# EAGLE design OttoPi06a-RPi3AHAT (EAGLE 9.6.2)
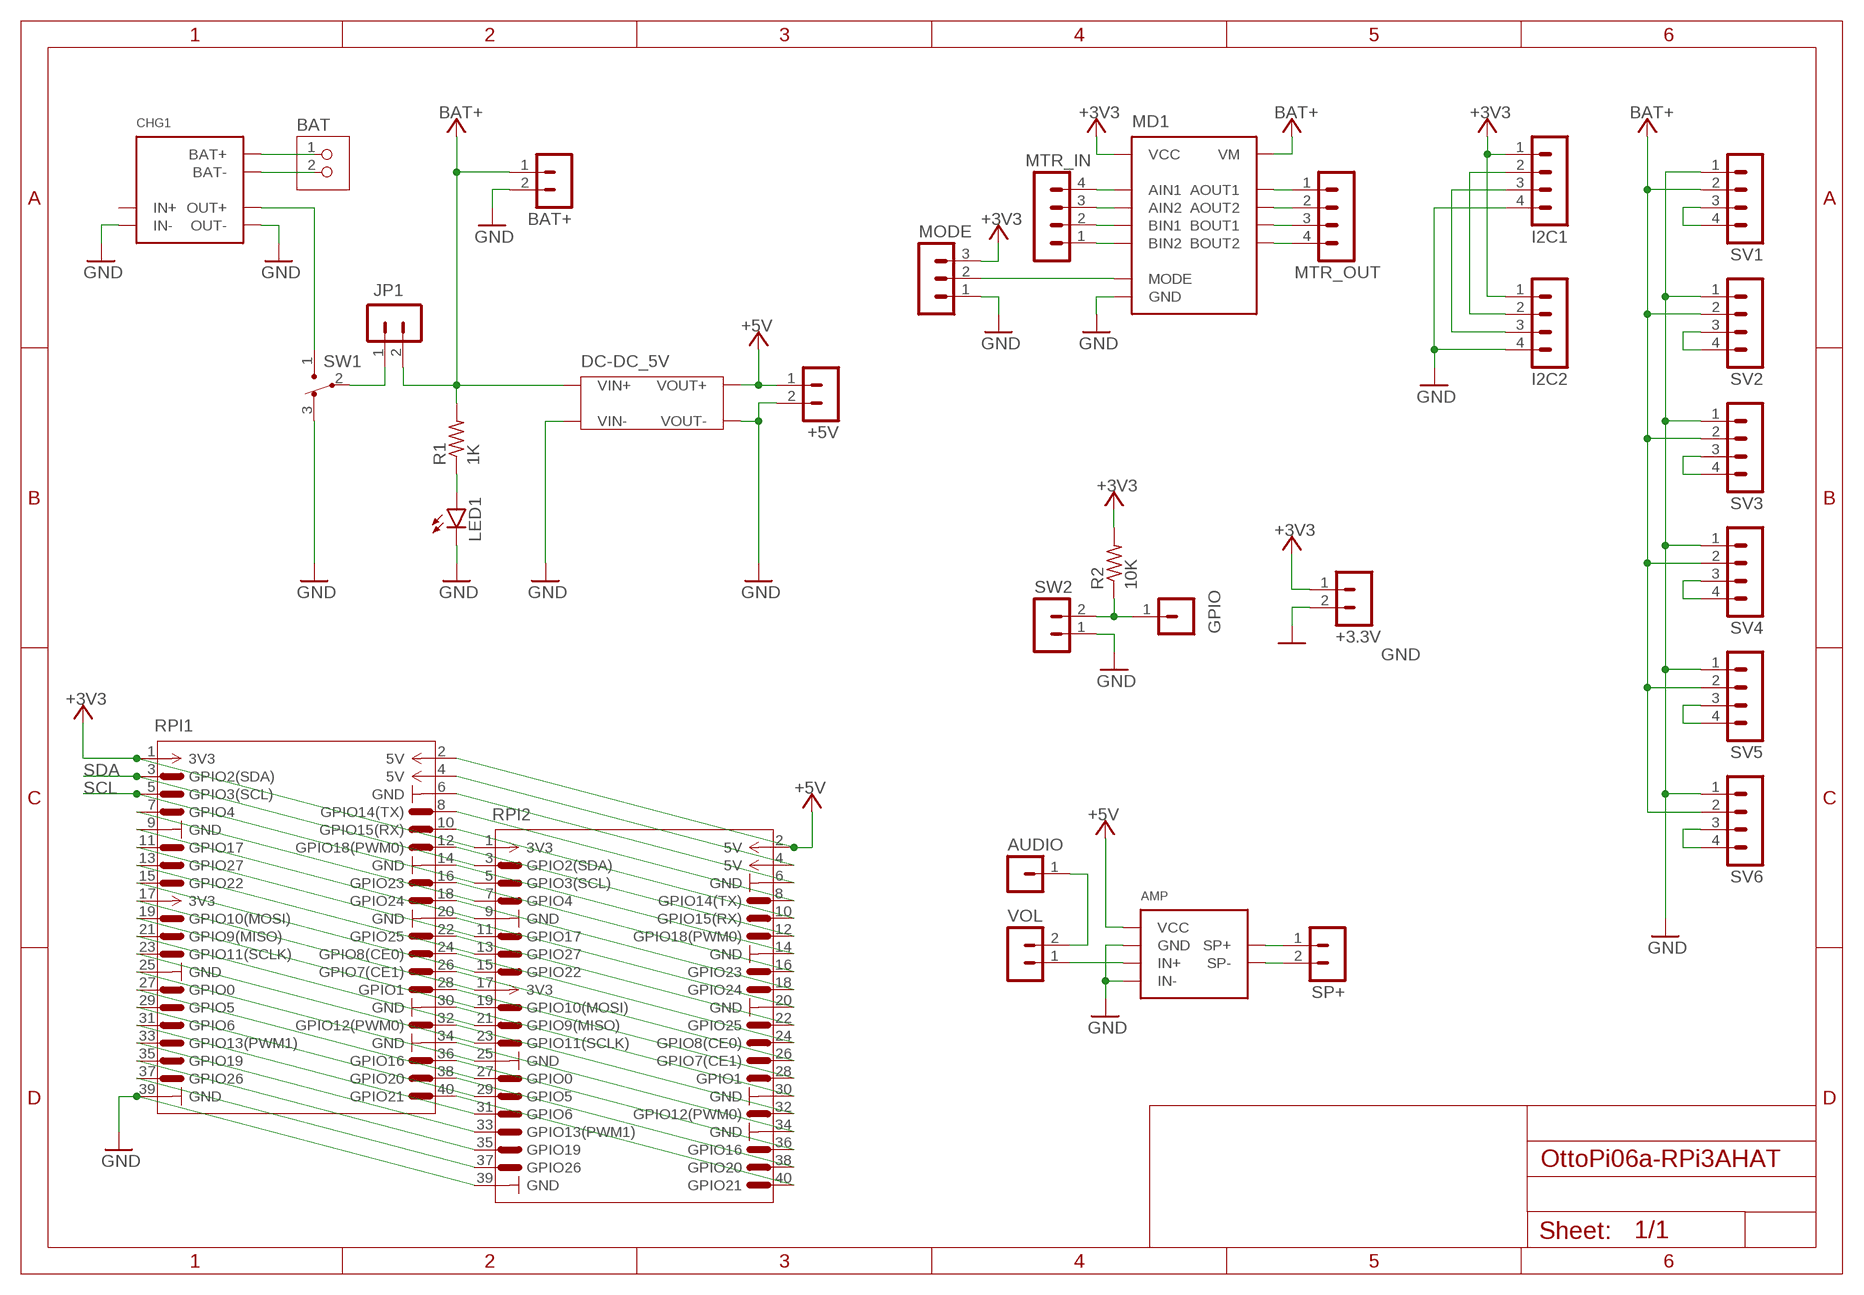
[diagram p0: schematic, sheet 1]

## Parts
+3.3V  MA02-1  [MA02-1]
+5V  MA02-1  [MA02-1]
AMP  PAM8012MOD  [PAM8012MOD-A]
AUDIO  MA01-1  [MA01-1]
BAT  JST-PH2  [JST-PH2]
BAT+  MA02-1  [MA02-1]
CHG1  TP4056MOD1  [TP4056MOD1]
DC-DC_5V  DCDC-5V_28V-2A  [DCDC-5V_28V-2A]
GPIO  MA01-1  [MA01-1]
I2C1  MA04-1  [MA04-1]
I2C2  MA04-1  [MA04-1]
JP1  MA02-1  [MA02-1]
LED1  LED3MM  [LED3MM]
MD1  DRV8835MOD  [DRV8835MOD]
MODE  MA03-1  [MA03-1]
MTR_IN  MA04-1  [MA04-1]
MTR_OUT  MA04-1  [MA04-1]
R1  1K  R-US_0204/7  [0204/7]
R2  10K  R-US_0204/7  [0204/7]
RPI1  RPI-PIN  [RPI-PIN]
RPI2  RPI-PIN  [RPI-PIN]
SP+  MA02-1  [MA02-1]
SV1  MA04-1  [MA04-1]
SV2  MA04-1  [MA04-1]
SV3  MA04-1  [MA04-1]
SV4  MA04-1  [MA04-1]
SV5  MA04-1  [MA04-1]
SV6  MA04-1  [MA04-1]
SW1  SW3-1  [SW3-1]
SW2  MA02-1  [MA02-1]
VOL  MA02-1  [MA02-1]

## Nets
+3V3: +3.3V.1 I2C1.1 I2C2.1 MD1.VCC MODE.3 R2.2 RPI1.1(3V3) RPI2.1(3V3)
+5V: +5V.1 AMP.V+(VCC) DC-DC_5V.VOUT+ RPI1.2(5V) RPI2.2(5V)
AIN1: MD1.AIN1 MTR_IN.4
AIN2: MD1.AIN2 MTR_IN.3
AOUT1: MD1.AOUT1 MTR_OUT.1
AOUT2: MD1.AOUT2 MTR_OUT.2
AUDIO0: AUDIO.1 VOL.2
AUDIO1: AMP.IN+ VOL.1
BAT+: BAT+.1 DC-DC_5V.VIN+ JP1.2 MD1.VM R1.2 SV1.2 SV2.2 SV3.2 SV4.2 SV5.2 SV6.2
BAT+0: BAT.1 CHG1.BAT+
BAT+1: CHG1.OUT+ SW1.1
BAT+2: JP1.1 SW1.2
BAT-0: BAT.2 CHG1.BAT-
BIN1: MD1.BIN1 MTR_IN.2
BIN2: MD1.BIN2 MTR_IN.1
BOUT1: MD1.BOUT1 MTR_OUT.3
BOUT2: MD1.BOUT2 MTR_OUT.4
GND: +3.3V.2 +5V.2 AMP.GND AMP.IN- BAT+.2 CHG1.IN- CHG1.OUT- DC-DC_5V.VIN- DC-DC_5V.VOUT- I2C1.4 I2C2.4 LED1.K(C) MD1.GND MODE.1 RPI1.39(GND) RPI2.39(GND) SV1.1 SV2.1 SV3.1 SV4.1 SV5.1 SV6.1 SW1.3 SW2.1
MODE: MD1.MODE MODE.2
N$1: RPI1.17(3V3) RPI2.17(3V3)
N$3: LED1.A R1.1
N$4: GPIO.1 R2.1 SW2.2
N$7: RPI1.7(GPIO4) RPI2.7(GPIO4)
N$8: RPI1.9(GND) RPI2.9(GND)
N$9: RPI1.11(GPIO17) RPI2.11(GPIO17)
N$10: RPI1.13(GPIO27) RPI2.13(GPIO27)
N$11: RPI1.15(GPIO22) RPI2.15(GPIO22)
N$12: RPI1.23(GPIO11(SCLK)) RPI2.23(GPIO11(SCLK))
N$13: RPI1.19(GPIO10(MOSI)) RPI2.19(GPIO10(MOSI))
N$14: RPI1.21(GPIO9(MISO)) RPI2.21(GPIO9(MISO))
N$16: RPI1.4(5V) RPI2.4(5V)
N$17: RPI1.6(GND) RPI2.6(GND)
N$18: RPI1.8(GPIO14(TX)) RPI2.8(GPIO14(TX))
N$19: RPI1.10(GPIO15(RX)) RPI2.10(GPIO15(RX))
N$20: RPI1.12(GPIO18(PWM0)) RPI2.12(GPIO18(PWM0))
N$21: RPI1.16(GPIO23) RPI2.16(GPIO23)
N$22: RPI1.18(GPIO24) RPI2.18(GPIO24)
N$23: RPI1.22(GPIO25) RPI2.22(GPIO25)
N$24: RPI1.14(GND) RPI2.14(GND)
N$26: RPI1.20(GND) RPI2.20(GND)
N$27: RPI1.24(GPIO8(CE0)) RPI2.24(GPIO8(CE0))
N$28: RPI1.26(GPIO7(CE1)) RPI2.26(GPIO7(CE1))
N$29: RPI1.27(GPIO0) RPI2.27(GPIO0)
N$30: RPI1.28(GPIO1) RPI2.28(GPIO1)
N$31: RPI1.29(GPIO5) RPI2.29(GPIO5)
N$32: RPI1.31(GPIO6) RPI2.31(GPIO6)
N$33: RPI1.32(GPIO12(PWM0)) RPI2.32(GPIO12(PWM0))
N$34: RPI1.33(GPIO13(PWM1)) RPI2.33(GPIO13(PWM1))
N$35: RPI1.35(GPIO19) RPI2.35(GPIO19)
N$36: RPI1.36(GPIO16) RPI2.36(GPIO16)
N$37: RPI1.37(GPIO26) RPI2.37(GPIO26)
N$38: RPI1.38(GPIO20) RPI2.38(GPIO20)
N$39: RPI1.40(GPIO21) RPI2.40(GPIO21)
N$40: RPI1.25(GND) RPI2.25(GND)
N$41: RPI1.30(GND) RPI2.30(GND)
N$42: RPI1.34(GND) RPI2.34(GND)
N$47: SV2.3 SV2.4
N$48: SV3.3 SV3.4
N$49: SV4.3 SV4.4
N$51: SV1.3 SV1.4
N$63: SV5.3 SV5.4
N$64: SV6.3 SV6.4
SCL: I2C1.3 I2C2.3 RPI1.5(GPIO3(SCL)) RPI2.5(GPIO3(SCL))
SDA: I2C1.2 I2C2.2 RPI1.3(GPIO2(SDA)) RPI2.3(GPIO2(SDA))
SP+: AMP.SP+@1(SP+) SP+.1
SP-: AMP.SP-@1(SP-) SP+.2
Unconnected: CHG1.IN+

## Library data of the parts
+3.3V +5V BAT+ JP1 SP+ SW2 VOL = ytani-con-lstb:MA02-1: PIN HEADER
AMP = ytani1:PAM8012MOD: PAM8012使用2W D級アンプモジュール https://akizukidenshi.com/catalog/g/gK-08217/ Vin: 2.5V-5.5V 8ohm: 1W 4ohm: 2W IN-をGNDに接続することでシングルエンド入力としても使用できます。; CHIP1: PAM8012; OC_AKIZUKI: K-08217; URL_AKIZUKI: https://akizukidenshi.com/catalog/g/gK-08217/
AUDIO GPIO = ytani-con-lstb:MA01-1
BAT = ytani1:JST-PH2
CHG1 = ytani1:TP4056MOD1: LiPoバッテリー充電コントローラ(TP4056) https://www.amazon.co.jp/dp/B073J66H62/; URL_AMAZON: https://www.amazon.co.jp/dp/B073J66H62/
DC-DC_5V = ytani1:DCDC-5V_28V-2A: Step-Up DC/DC converter https://www.amazon.co.jp/gp/product/B01D0WSBGY/ In 2V-24V Out 5V-28V = [VALUE] Max: 2A (1A recomended); URL_AMAZON: https://www.amazon.co.jp/gp/product/B01D0WSBGY/
I2C1 I2C2 MTR_IN MTR_OUT SV1-SV6 = ytani-con-lstb:MA04-1: PIN HEADER; OC_FARNELL: unknown; OC_NEWARK: unknown
LED1 = led:LED: LED OSRAM: - CHIPLED LG R971, LG N971, LY N971, LG Q971, LY Q971, LO R971, LY R971 LH N974, LH R974 LS Q976, LO Q976, LY Q976 LO Q996 - Hyper CHIPLED LW Q18S LB Q993, LB Q99A, LB R99A - SideLED LS A670, LO A670, LY A670, LG A670, LP A670 LB A673, LV A673, LT A673, LW A673 LH A674 LY A675 LS A676, LA A676, LO A676, LY A676, LW A676 LS A679, LY A679, LG A679 - Hyper Micro SIDELED® LS Y876, LA Y876, LO Y876, LY Y876 LT Y87S - SmartLED LW L88C, LW L88S LB L89C, LB L89S, LG L890 LS L89K, LO L89K, LY L89K LS L896, LA L896, LO L896, LY L896 - TOPLED LS T670, LO T670, LY T670, LG T670, LP T670 LSG T670, LSP T670, LSY T670, LOP T670, LYG T670 LG T671, LOG T671, LSG T671 LB T673, LV T673, LT T673, LW T673 LH T674 LS T676, LA T676, LO T676, LY T676, LB T676, LH T676, LSB T676, LW T676 LB T67C, LV T67C, LT T67C, LS T67K, LO T67K, LY T67K, LW E67C LS E67B, LA E67B, LO E67B, LY E67B, LB E67C, LV E67C, LT E67C LW T67C LS T679, LY T679, LG T679 LS T770, LO T770, LY T770, LG T770, LP T770 LB T773, LV T773, LT T773, LW T773 LH T774 LS E675, LA E675, LY E675, LS T675 LS T776, LA T776, LO T776, LY T776, LB T776 LHGB T686 LT T68C, LB T68C - Hyper Mini TOPLED® LB M676 - Mini TOPLED Santana® LG M470 LS M47K, LO M47K, LY M47K Source: http://www.osram.convergy.de LUXEON: - LUMILED® LXK2-PW12-R00, LXK2-PW12-S00, LXK2-PW14-U00, LXK2-PW14-V00 LXK2-PM12-R00, LXK2-PM12-S00, LXK2-PM14-U00 LXK2-PE12-Q00, LXK2-PE12-R00, LXK2-PE12-S00, LXK2-PE14-T00, LXK2-PE14-U00 LXK2-PB12-K00, LXK2-PB12-L00, LXK2-PB12-M00, LXK2-PB14-N00, LXK2-PB14-P00, LXK2-PB14-Q00 LXK2-PR12-L00, LXK2-PR12-M00, LXK2-PR14-Q00, LXK2-PR14-R00 LXK2-PD12-Q00, LXK2-PD12-R00, LXK2-PD12-S00 LXK2-PH12-R00, LXK2-PH12-S00 LXK2-PL12-P00, LXK2-PL12-Q00, LXK2-PL12-R00 Source: www.luxeon.com KINGBRIGHT: KA-3528ASYC Source: www.kingbright.com
MD1 = ytani1:DRV8835MOD: DRV8835 Motor Driver Module https://akizukidenshi.com/catalog/g/gK-09848/ Vcc = 2V-7V Vm = 0V-11V Iout = 0V-1.5A Fpwm = 0Hz-250kHz Vin = 0V-Vcc; OC_AKIZUKI: K-09848; URL_AKIZUKI: https://akizukidenshi.com/catalog/g/gK-09848/
MODE = ytani-con-lstb:MA03-1: PIN HEADER; OC_FARNELL: unknown; OC_NEWARK: unknown
R1 R2 = rcl:R-US_: RESISTOR, American symbol; SPICEPREFIX: R
RPI1 RPI2 = ytani1:RPI-PIN: Raspberry Pi pin header
SW1 = ytani1:SW3-1: Slide Switch 3x1 pin https://www.amazon.co.jp/gp/product/B01LYVYQNO/ SS12D00G3 2ポジションSPDT 1P2T 3ピン; MF: HiLetgo; URL_AMAZON: https://www.amazon.co.jp/gp/product/B01LYVYQNO/

## Board
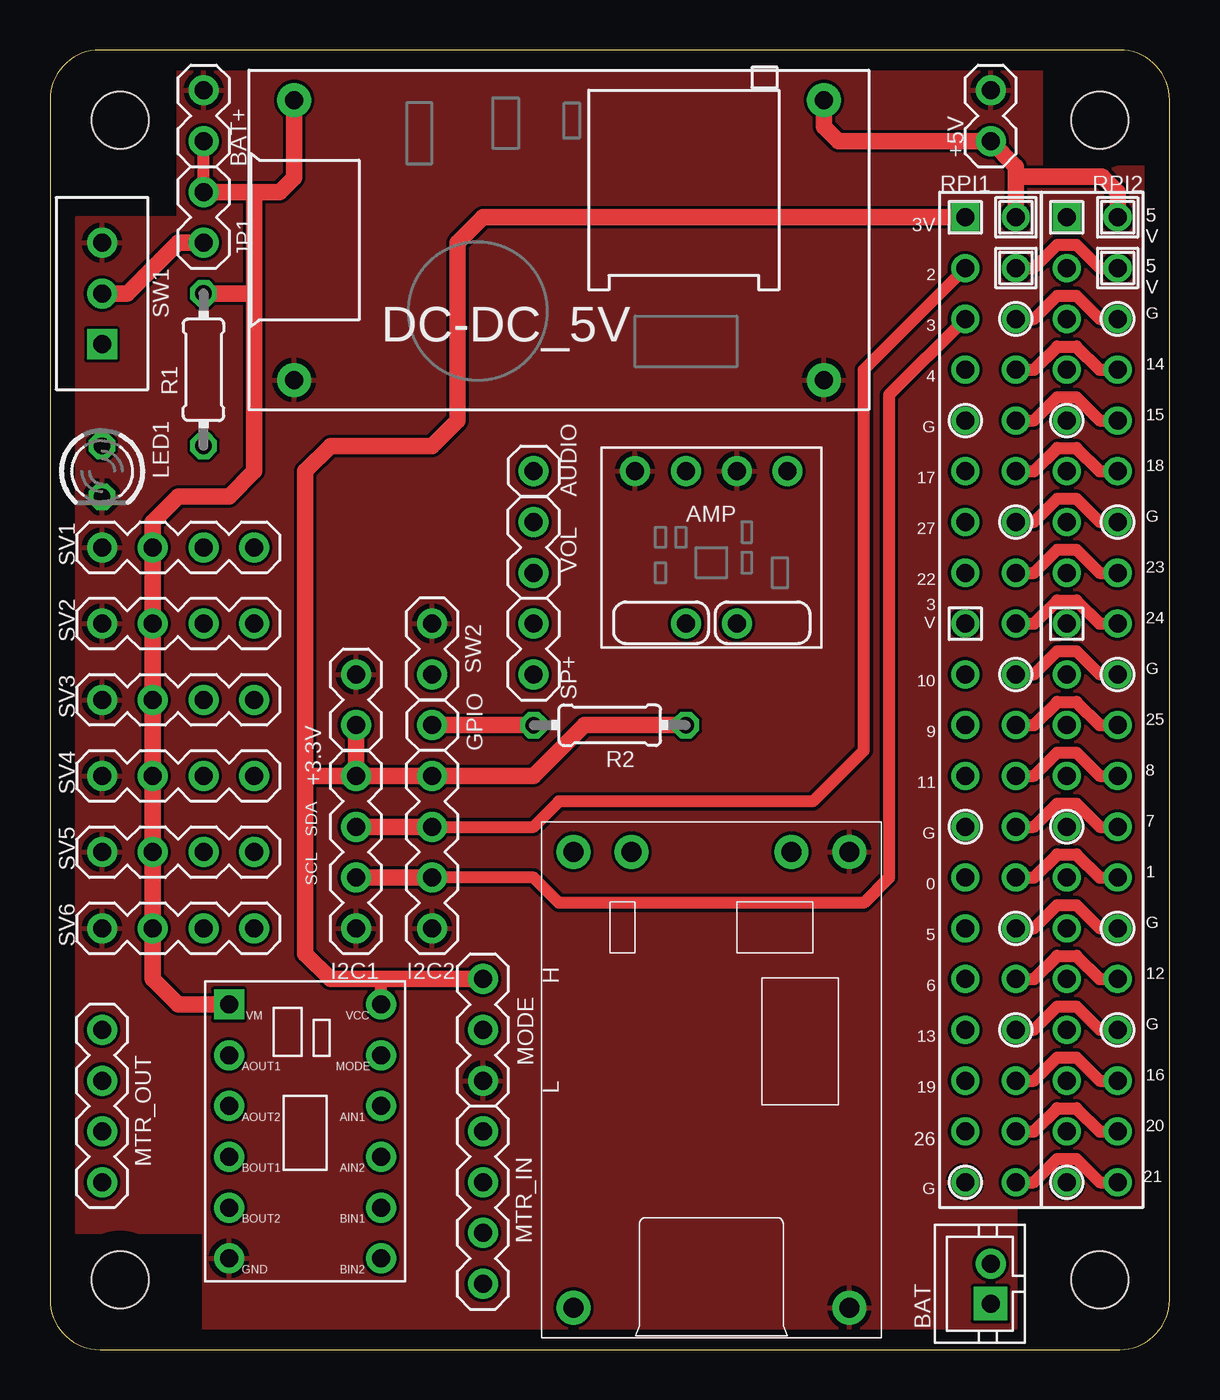
[diagram p1: board, top side]
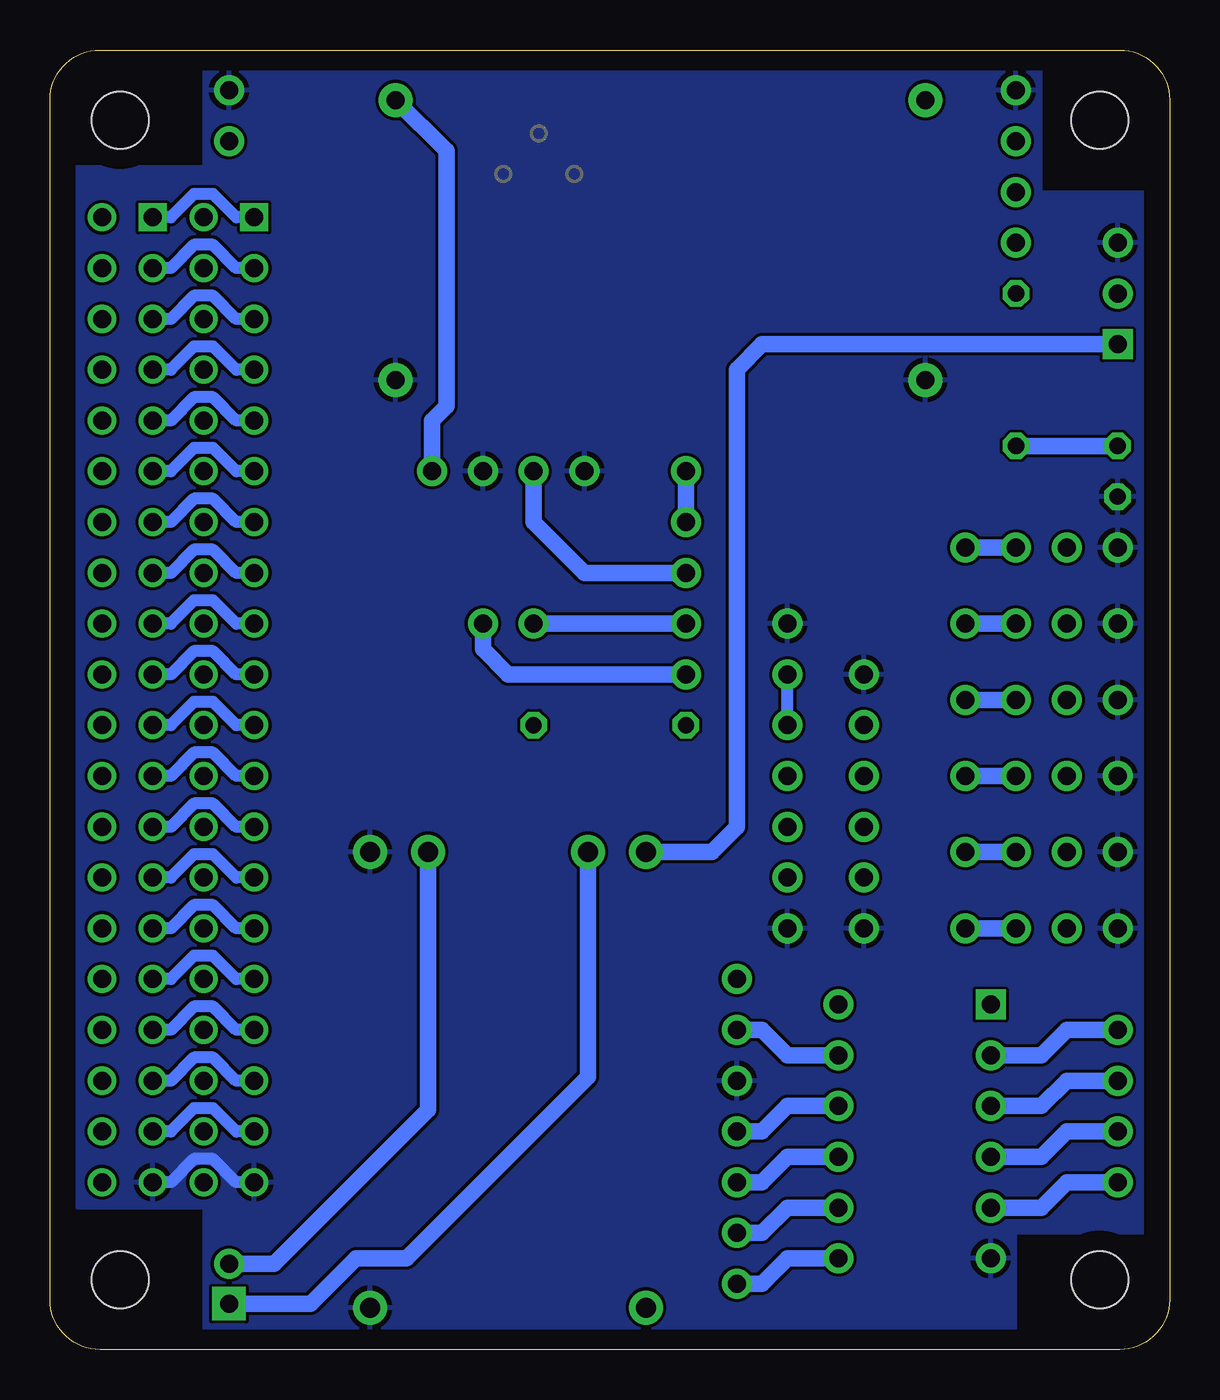
[diagram p2: board, bottom side, seen from below]

Size 56 x 65 mm. Coordinates in mm from the lower left corner, seen from the top.
Outline: 2.5,0 53.5,0 arc90 56,2.5 56,62.5 arc90 53.5,65 2.5,65 arc90 0,62.5 0,2.5 arc90 2.5,0
Copper layers (1*16): Top 0.035mm / dielectric 1.5mm / Bottom 0.035mm
Design rules "default": minimum track width 6mil, minimum drill 0.35mm, track to track 6mil, track to pad 6mil, pad to pad 6mil, via to via 6mil, smd to smd 6mil, copper to edge 40mil, drill to drill 6mil, minimum pad ring 10mil, minimum via ring 8mil, stop-mask expansion 4mil, vias tented up to drill 0mil, thermal gap 10mil
Holes 2.85 mm at 52.5,3.5 52.5,61.5 3.5,61.5 3.5,3.5

### Footprints (pad centres in the part's own frame; a part is rotated, then mirrored left to right if it is on the bottom)
MA02-1 = drill 0.9 pad 1.5: 1 -1.27,0; 2 1.27,0
PAM8012MOD-A = drill 0.9 pad 1.5: GND -3.81,1.27; IN+ -3.81,-1.27; IN- -3.81,-3.81; SP+@1 3.81,1.27; SP-@1 3.81,-1.27; V+ -3.81,3.81
MA01-1 = drill 0.9 pad 1.5: 1 1.27,0
JST-PH2 = drill 0.9 pad 1.676 square: 1 -1,0 | drill 0.9 pad 1.5: 2 1,0
TP4056MOD1 = drill 1 pad 1.7: BAT+ 11.4,4; BAT- 11.4,-4; IN+ -11.4,6.9; IN- -11.4,-6.9; OUT+ 11.4,6.9; OUT- 11.4,-6.9
DCDC-5V_28V-2A = drill 0.9 pad 1.7: VIN+ -13.25,7; VIN- -13.25,-7; VOUT+ 13.25,7; VOUT- 13.25,-7
MA04-1 = drill 0.9 pad 1.5: 1 -3.81,0; 2 -1.27,0; 3 1.27,0; 4 3.81,0
LED3MM = drill 0.813 octagon: A -1.27,0; K 1.27,0
DRV8835MOD = drill 0.9 pad 1.5: AIN1 5.08,5.08; AIN2 5.08,2.54; AOUT1 -2.54,7.62; AOUT2 -2.54,5.08; BIN1 5.08,0; BIN2 5.08,-2.54; BOUT1 -2.54,2.54; BOUT2 -2.54,0; GND -2.54,-2.54; MODE 5.08,7.62; VCC 5.08,10.16 | drill 0.9 pad 1.5 square: VM -2.54,10.16
MA03-1 = drill 0.9 pad 1.5: 1 -1.27,0; 2 1.27,0; 3 3.81,0
0204/7 = drill 0.813 octagon: 1 -3.81,0; 2 3.81,0
RPI-PIN = drill 0.9 square: 1 -1.27,24.13 | drill 0.9: 2 1.27,24.13; 3 -1.27,21.59; 4 1.27,21.59; 5 -1.27,19.05; 6 1.27,19.05; 7 -1.27,16.51; 8 1.27,16.51; 9 -1.27,13.97; 10 1.27,13.97; 11 -1.27,11.43; 12 1.27,11.43; 13 -1.27,8.89; 14 1.27,8.89; 15 -1.27,6.35; 16 1.27,6.35; 17 -1.27,3.81; 18 1.27,3.81; 19 -1.27,1.27; 20 1.27,1.27; 21 -1.27,-1.27; 22 1.27,-1.27; 23 -1.27,-3.81; 24 1.27,-3.81; 25 -1.27,-6.35; 26 1.27,-6.35; 27 -1.27,-8.89; 28 1.27,-8.89; 29 -1.27,-11.43; 30 1.27,-11.43; 31 -1.27,-13.97; 32 1.27,-13.97; 33 -1.27,-16.51; 34 1.27,-16.51; 35 -1.27,-19.05; 36 1.27,-19.05; 37 -1.27,-21.59; 38 1.27,-21.59; 39 -1.27,-24.13; 40 1.27,-24.13
SW3-1 = drill 0.9 pad 1.5 square: 1 -1.27,0 | drill 0.9 pad 1.5: 2 1.27,0; 3 3.81,0

### Placement (x,y rotation side)
+3.3V  15.3,32.5 90 top
+5V  47.05,61.71 90 top
AMP  33.08,40.12 270 top
AUDIO  22.92,43.93 0 top
BAT  47.05,3.29 90 top
BAT+  7.68,61.71 90 top
CHG1  33.08,13.5 90 top
DC-DC_5V  25.46,55.5 0 top
GPIO  17.84,31.23 0 top
I2C1  15.3,24.88 270 top
I2C2  19.11,24.88 270 top
JP1  7.68,56.63 90 top
LED1  2.6,43.93 270 top
MD1  11.49,7.1 0 top
MODE  21.65,14.72 90 top
MTR_IN  21.65,7.1 90 top
MTR_OUT  2.6,12.18 270 top
R1  7.68,49.01 90 top
R2  28,31.23 0 top
RPI1  47.05,32.5 0 top
RPI2  52.13,32.5 0 top
SP+  24.19,35.04 90 top
SV1  6.41,40.12 0 top
SV2  6.41,36.31 0 top
SV3  6.41,32.5 0 top
SV4  6.41,28.69 0 top
SV5  6.41,24.88 0 top
SV6  6.41,21.07 0 top
SW1  2.6,51.55 90 top
SW2  19.11,35.04 270 top
VOL  24.19,40.12 90 top

### Tracks (layer width: path | path; a pad name or v marks a point on that pad's centre or on a via)
+3V3
  Top 0.61: MODE.3 16.57,18.53 | 16.57,18.53 14.03,18.53 | 12.76,19.8 12.76,28.69 12.76,43.93 | MD1.VCC 16.57,18.53
  Top 0.813: I2C1.1 I2C2.1 24.19,28.69 26.73,31.23 R2.2 | I2C1.1 +3.3V.1 | 12.76,28.69 I2C1.1 | MODE.3 14.03,18.53 12.76,19.8 12.76,43.93 14.03,45.2 19.11,45.2 20.38,46.47 20.38,55.36 21.65,56.63 RPI1.1
  Bottom 0.61: RPI1.1 46.68,56.63 47.84,57.79 48.8,57.79 49.96,56.63 RPI2.1
+5V
  Top 0.813: RPI2.2 53.4,57.9 52.65,58.65 48.32,58.65 | 48.32,58.65 48.32,59.17 +5V.1 39.43,60.44 38.71,61.16 DC-DC_5V.VOUT+ | RPI1.2 48.32,58.65
  Bottom 0.813: DC-DC_5V.VOUT+ 36.17,59.96 36.17,47.19 36.89,46.47 AMP.V+
AIN1
  Bottom 0.813: MTR_IN.4 20.38,10.91 19.11,12.18 MD1.AIN1
AIN2
  Bottom 0.813: MTR_IN.3 20.38,8.37 19.11,9.64 MD1.AIN2
AOUT1
  Bottom 0.813: MD1.AOUT1 6.41,14.72 5.14,15.99 MTR_OUT.1
AOUT2
  Bottom 0.813: MD1.AOUT2 6.41,12.18 5.14,13.45 MTR_OUT.2
AUDIO0
  Bottom 0.813: AUDIO.1 VOL.2
AUDIO1
  Bottom 0.813: AMP.IN+ 31.81,41.39 29.27,38.85 VOL.1
BAT+
  Top 0.61: JP1.2 BAT+.1
  Top 0.813: R1.2 10.22,52.82 | MD1.VM 6.41,17.26 5.14,18.53 SV6.2 SV5.2 SV4.2 SV3.2 SV2.2 SV1.2 5.14,41.39 6.41,42.66 8.95,42.66 10.22,43.93 10.22,52.82 | JP1.2 10.22,57.9 | 10.22,52.82 10.22,57.9 | DC-DC_5V.VIN+ 12.21,58.62 11.49,57.9 10.22,57.9
BAT+0
  Bottom 0.813: BAT.1 42.97,2.29 40.7,4.56 38.16,4.56 29.08,13.64 CHG1.BAT+
BAT+1
  Bottom 0.813: SW1.1 20.38,50.28 21.65,49.01 21.65,26.15 22.9,24.9 CHG1.OUT+
BAT+2
  Top 0.813: SW1.2 3.87,52.82 6.41,55.36 JP1.1
BAT-0
  Bottom 0.813: BAT.2 44.78,4.29 37.08,11.99 CHG1.BAT-
BIN1
  Bottom 0.813: MTR_IN.2 20.38,5.83 19.11,7.1 MD1.BIN1
BIN2
  Bottom 0.813: MTR_IN.1 20.38,3.29 19.11,4.56 MD1.BIN2
BOUT1
  Bottom 0.813: MD1.BOUT1 6.41,9.64 5.14,10.91 MTR_OUT.3
BOUT2
  Bottom 0.813: MD1.BOUT2 6.41,7.1 5.14,8.37 MTR_OUT.4
GND
  Bottom 0.61: RPI1.39 46.68,8.37 47.84,9.53 48.8,9.53 49.96,8.37 RPI2.39
  pour Bottom: 1.33,57.9 6.41,57.9 6.41,64.25 48.32,64.25 48.32,59.17 54.67,59.17 54.67,7.1 48.32,7.1 48.32,0.75 7.68,0.75 7.68,5.83 1.33,5.83
  pour Top: 1.33,56.63 6.41,56.63 6.41,64.25 49.59,64.25 49.59,59.17 54.67,59.17 54.67,7.1 48.32,7.1 48.32,0.75 7.68,0.75 7.68,5.83 1.33,5.83
MODE
  Bottom 0.813: MD1.MODE 19.11,14.72 20.38,15.99 MODE.2
N$1
  Bottom 0.61: RPI1.17 46.68,36.31 47.84,37.47 48.8,37.47 49.96,36.31 RPI2.17
N$3
  Bottom 0.813: R1.1 LED1.A
N$4
  Top 0.813: GPIO.1 R2.1
  Bottom 0.61: GPIO.1 SW2.2
N$7
  Bottom 0.61: RPI1.7 46.68,49.01 47.84,50.17 48.8,50.17 49.96,49.01 RPI2.7
N$8
  Bottom 0.61: RPI1.9 46.68,46.47 47.84,47.63 48.8,47.63 49.96,46.47 RPI2.9
N$9
  Bottom 0.61: RPI1.11 46.68,43.93 47.84,45.09 48.8,45.09 49.96,43.93 RPI2.11
N$10
  Bottom 0.61: RPI1.13 46.68,41.39 47.84,42.55 48.8,42.55 49.96,41.39 RPI2.13
N$11
  Bottom 0.61: RPI1.15 46.68,38.85 47.84,40.01 48.8,40.01 49.96,38.85 RPI2.15
N$12
  Bottom 0.61: RPI1.23 46.68,28.69 47.84,29.85 48.8,29.85 49.96,28.69 RPI2.23
N$13
  Bottom 0.61: RPI1.19 46.68,33.77 47.84,34.93 48.8,34.93 49.96,33.77 RPI2.19
N$14
  Bottom 0.61: RPI1.21 46.68,31.23 47.84,32.39 48.8,32.39 49.96,31.23 RPI2.21
N$16
  Top 0.61: RPI1.4 49.22,54.09 50.38,55.25 51.34,55.25 52.5,54.09 RPI2.4
N$17
  Top 0.61: RPI1.6 49.22,51.55 50.38,52.71 51.34,52.71 52.5,51.55 RPI2.6
N$18
  Top 0.61: RPI1.8 49.22,49.01 50.38,50.17 51.34,50.17 52.5,49.01 RPI2.8
N$19
  Top 0.61: RPI1.10 49.22,46.47 50.38,47.63 51.34,47.63 52.5,46.47 RPI2.10
N$20
  Top 0.61: RPI1.12 49.22,43.93 50.38,45.09 51.34,45.09 52.5,43.93 RPI2.12
N$21
  Top 0.61: RPI1.16 49.22,38.85 50.38,40.01 51.34,40.01 52.5,38.85 RPI2.16
N$22
  Top 0.61: RPI1.18 49.22,36.31 50.38,37.47 51.34,37.47 52.5,36.31 RPI2.18
N$23
  Top 0.61: RPI1.22 49.22,31.23 50.38,32.39 51.34,32.39 52.5,31.23 RPI2.22
N$24
  Top 0.61: RPI1.14 49.22,41.39 50.38,42.55 51.34,42.55 52.5,41.39 RPI2.14
N$26
  Top 0.61: RPI1.20 49.22,33.77 50.38,34.93 51.34,34.93 52.5,33.77 RPI2.20
N$27
  Top 0.61: RPI1.24 49.22,28.69 50.38,29.85 51.34,29.85 52.5,28.69 RPI2.24
N$28
  Top 0.61: RPI1.26 49.22,26.15 50.38,27.31 51.34,27.31 52.5,26.15 RPI2.26
N$29
  Bottom 0.61: RPI1.27 46.68,23.61 47.84,24.77 48.8,24.77 49.96,23.61 RPI2.27
N$30
  Top 0.61: RPI1.28 49.22,23.61 50.38,24.77 51.34,24.77 52.5,23.61 RPI2.28
N$31
  Bottom 0.61: RPI1.29 46.68,21.07 47.84,22.23 48.8,22.23 49.96,21.07 RPI2.29
N$32
  Bottom 0.61: RPI1.31 46.68,18.53 47.84,19.69 48.8,19.69 49.96,18.53 RPI2.31
N$33
  Top 0.61: RPI1.32 49.22,18.53 50.38,19.69 51.34,19.69 52.5,18.53 RPI2.32
N$34
  Bottom 0.61: RPI1.33 46.68,15.99 47.84,17.15 48.8,17.15 49.96,15.99 RPI2.33
N$35
  Bottom 0.61: RPI1.35 46.68,13.45 47.84,14.61 48.8,14.61 49.96,13.45 RPI2.35
N$36
  Top 0.61: RPI1.36 49.22,13.45 50.38,14.61 51.34,14.61 52.5,13.45 RPI2.36
N$37
  Bottom 0.61: RPI1.37 46.68,10.91 47.84,12.07 48.8,12.07 49.96,10.91 RPI2.37
N$38
  Top 0.61: RPI1.38 49.22,10.91 50.38,12.07 51.34,12.07 52.5,10.91 RPI2.38
N$39
  Top 0.61: RPI1.40 49.22,8.37 50.38,9.53 51.34,9.53 52.5,8.37 RPI2.40
N$40
  Bottom 0.61: RPI1.25 46.68,26.15 47.84,27.31 48.8,27.31 49.96,26.15 RPI2.25
N$41
  Top 0.61: RPI1.30 49.22,21.07 50.38,22.23 51.34,22.23 52.5,21.07 RPI2.30
N$42
  Top 0.61: RPI1.34 49.22,15.99 50.38,17.15 51.34,17.15 52.5,15.99 RPI2.34
N$47
  Bottom 0.813: SV2.3 SV2.4
N$48
  Bottom 0.813: SV3.3 SV3.4
N$49
  Bottom 0.813: SV4.3 SV4.4
N$51
  Bottom 0.813: SV1.3 SV1.4
N$63
  Bottom 0.813: SV5.3 SV5.4
N$64
  Bottom 0.813: SV6.3 SV6.4
SCL
  Top 0.61: RPI1.5 41.97,47.74 41.97,23.61 40.7,22.34 25.46,22.34 24.19,23.61 I2C2.3
  Top 0.813: I2C2.3 I2C1.3
  Bottom 0.61: RPI1.5 46.68,51.55 47.84,52.71 48.8,52.71 49.96,51.55 RPI2.5
SDA
  Top 0.61: RPI1.3 40.7,49.01 40.7,29.96 38.16,27.42 25.46,27.42 24.19,26.15 I2C2.2
  Top 0.813: I2C2.2 I2C1.2
  Bottom 0.61: RPI1.3 46.68,54.09 47.84,55.25 48.8,55.25 49.96,54.09 RPI2.3
SP+
  Bottom 0.813: AMP.SP+@1 34.35,35.04 33.08,33.77 SP+.1
SP-
  Bottom 0.813: AMP.SP-@1 SP+.2

### Text on the board
tPlace: 3V | 5 / V | 2 | 5 / V | 3 | G | 4 | 14 | G | 15 | 17 | 18 | 27 | G | 22 | 23 | 3 / V | 24 | 10 | G | 9 | 25 | 11 | 8 | SDA | G | 7 | SCL | 0 | 1 | 5 | G | H | 6 | 12 | 13 | G | 19 | 16 | L | 26 | 20 | G | 21